# Altium project 24.067.PrjPCB
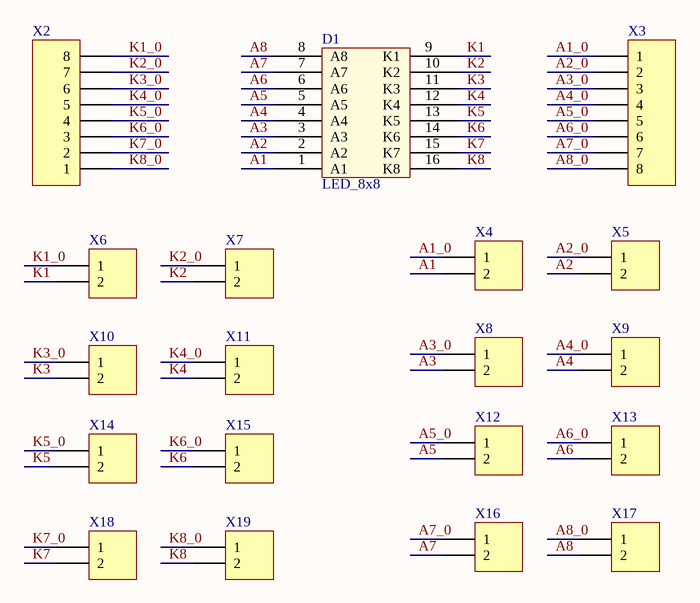
[diagram p0: 24.067.SchDoc]
1 sheet, 19 parts. Net scope: global (net labels, ports and power ports of the same name join across sheets).
Board file: 24.067.PcbDoc

## Sheet 24.067.SchDoc
size A4

### Parts
D1  LED_8x8  [LED_8x8]
X2  Header 8  [HDR1X8]  (value not drawn)
X3  Header 8  [HDR1X8]  (value not drawn)
X4  Header 2  [HDR1X2]  (value not drawn)
X5  Header 2  [HDR1X2]  (value not drawn)
X6  Header 2  [HDR1X2]  (value not drawn)
X7  Header 2  [HDR1X2]  (value not drawn)
X8  Header 2  [HDR1X2]  (value not drawn)
X9  Header 2  [HDR1X2]  (value not drawn)
X10  Header 2  [HDR1X2]  (value not drawn)
X11  Header 2  [HDR1X2]  (value not drawn)
X12  Header 2  [HDR1X2]  (value not drawn)
X13  Header 2  [HDR1X2]  (value not drawn)
X14  Header 2  [HDR1X2]  (value not drawn)
X15  Header 2  [HDR1X2]  (value not drawn)
X16  Header 2  [HDR1X2]  (value not drawn)
X17  Header 2  [HDR1X2]  (value not drawn)
X18  Header 2  [HDR1X2]  (value not drawn)
X19  Header 2  [HDR1X2]  (value not drawn)

### Nets
A1: D1.1(A1) X4.2
A1_0: X3.1 X4.1
A2: D1.2(A2) X5.2
A2_0: X3.2 X5.1
A3: D1.3(A3) X8.2
A3_0: X3.3 X8.1
A4: D1.4(A4) X9.2
A4_0: X3.4 X9.1
A5: D1.5(A5) X12.2
A5_0: X3.5 X12.1
A6: D1.6(A6) X13.2
A6_0: X3.6 X13.1
A7: D1.7(A7) X16.2
A7_0: X3.7 X16.1
A8: D1.8(A8) X17.2
A8_0: X3.8 X17.1
K1: D1.9(K1) X6.2
K1_0: X2.8 X6.1
K2: D1.10(K2) X7.2
K2_0: X2.7 X7.1
K3: D1.11(K3) X10.2
K3_0: X2.6 X10.1
K4: D1.12(K4) X11.2
K4_0: X2.5 X11.1
K5: D1.13(K5) X14.2
K5_0: X2.4 X14.1
K6: D1.14(K6) X15.2
K6_0: X2.3 X15.1
K7: D1.15(K7) X18.2
K7_0: X2.2 X18.1
K8: D1.16(K8) X19.2
K8_0: X2.1 X19.1

### Library data of the parts
X2 X3 = Header 8: Header, 8-Pin; LatestRevisionDate: 17-Jul-2002; LatestRevisionNote: Re-released for DXP Platform.; Publisher: Altium Limited
X4-X19 = Header 2: Header, 2-Pin; LatestRevisionDate: 17-Jul-2002; LatestRevisionNote: Re-released for DXP Platform.; Publisher: Altium Limited